# EAGLE design click sensor hub without IC 2019 (EAGLE 9.2.0)

## Sheet 1 of 2
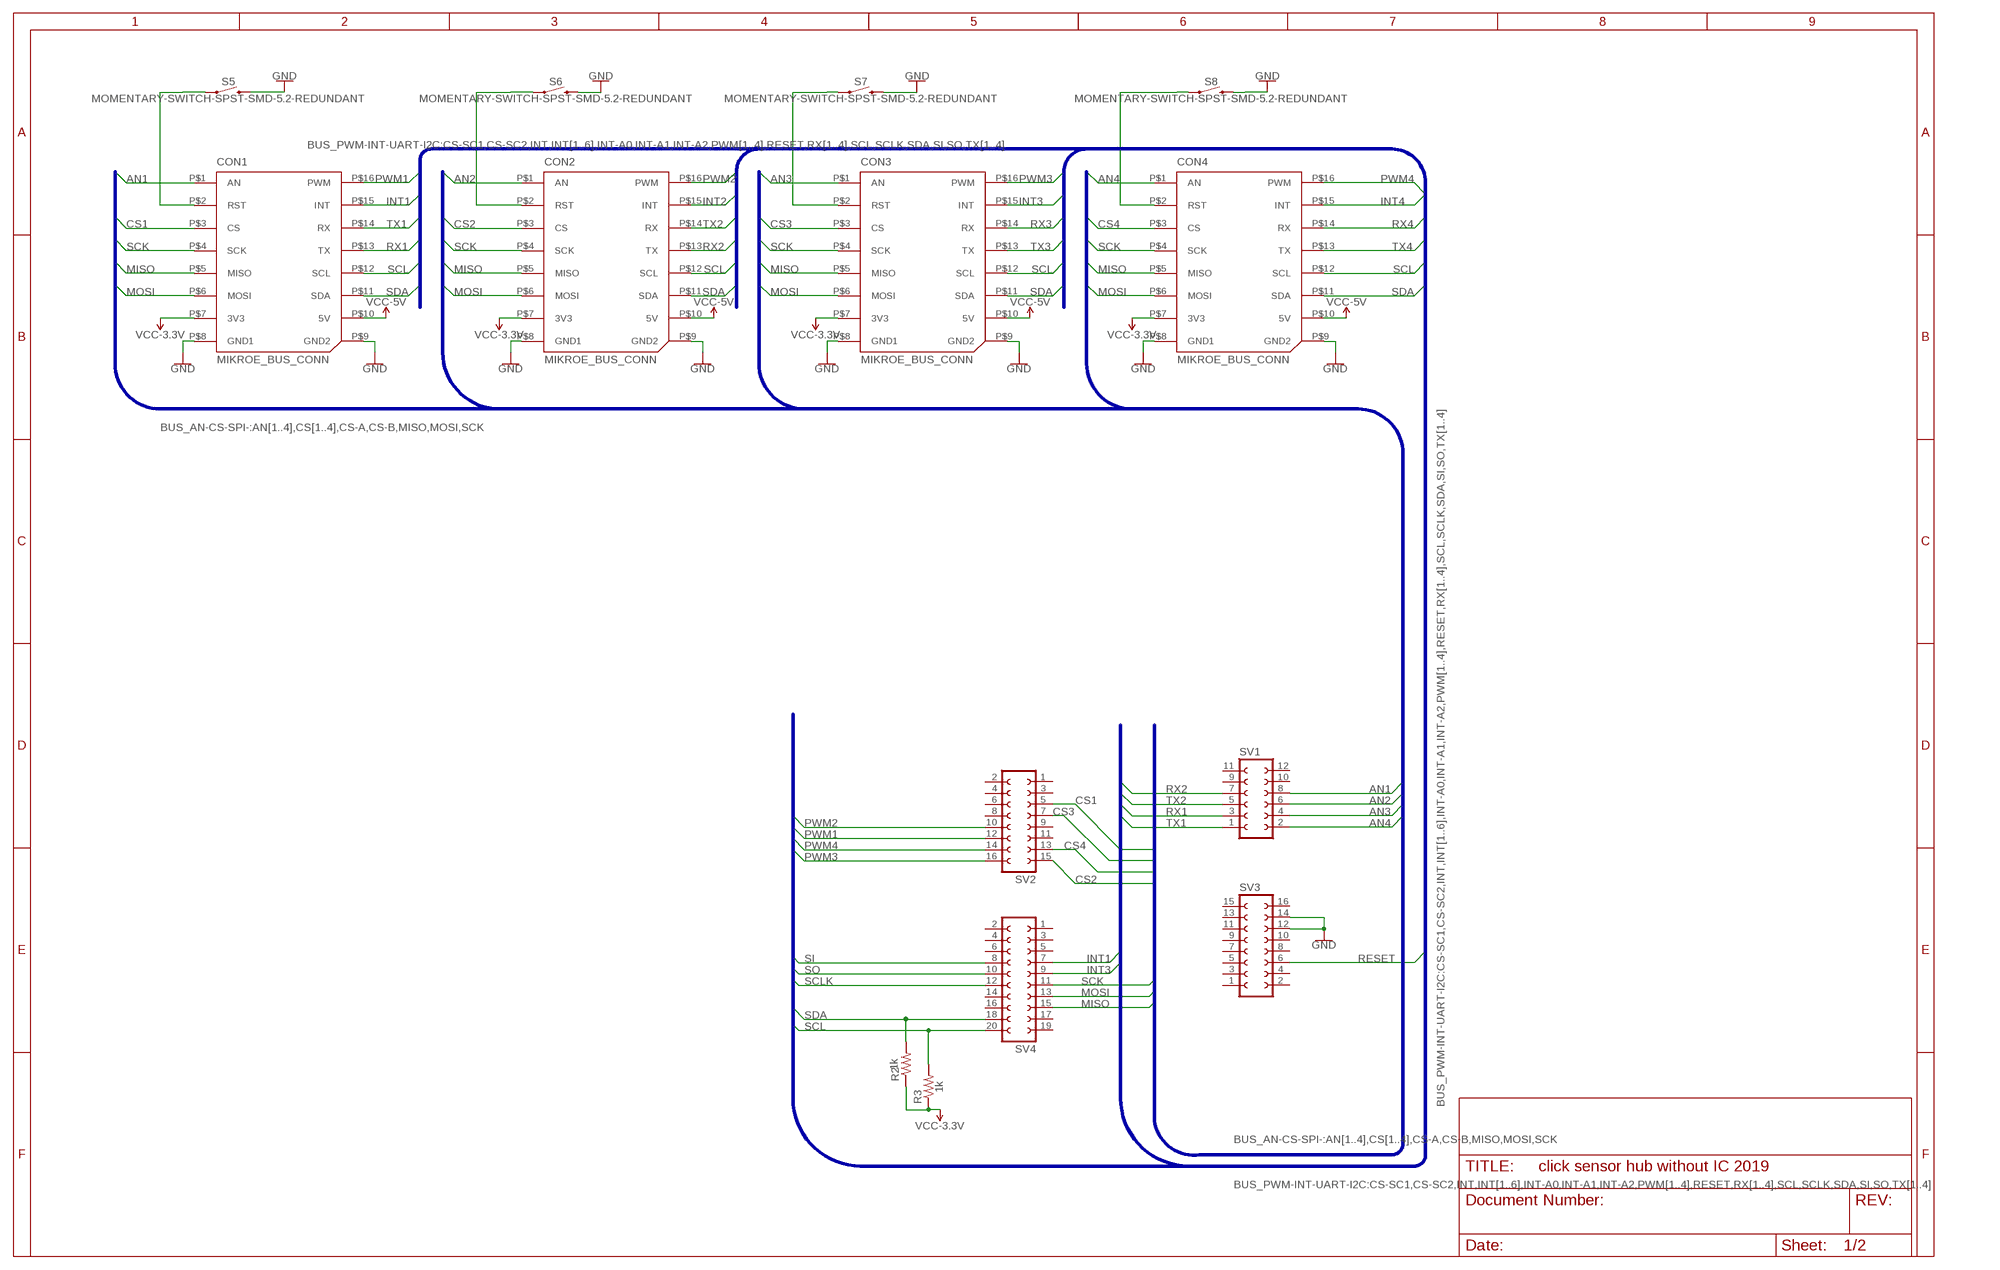
[diagram p0: schematic, sheet 1]

### Parts
CON1  MIKROE_BUS_CONN  [MIKROBUS_HOST_CONN]
CON2  MIKROE_BUS_CONN  [MIKROBUS_HOST_CONN]
CON3  MIKROE_BUS_CONN  [MIKROBUS_HOST_CONN]
CON4  MIKROE_BUS_CONN  [MIKROBUS_HOST_CONN]
R2  1k  R-US_R0805  [R0805]
R3  1k  R-US_R0805  [R0805]
S5  MOMENTARY-SWITCH-SPST-SMD-5.2-REDUNDANT  [TACTILE_SWITCH_SMD_5.2MM]
S6  MOMENTARY-SWITCH-SPST-SMD-5.2-REDUNDANT  [TACTILE_SWITCH_SMD_5.2MM]
S7  MOMENTARY-SWITCH-SPST-SMD-5.2-REDUNDANT  [TACTILE_SWITCH_SMD_5.2MM]
S8  MOMENTARY-SWITCH-SPST-SMD-5.2-REDUNDANT  [TACTILE_SWITCH_SMD_5.2MM]
SV1  FE06-2  [FE06-2]
SV2  FE08-2  [FE08-2]
SV3  FE08-2  [FE08-2]
SV4  FE10-2  [FE10-2]

### Nets
3.3V: CON1.P$7(3V3) CON2.P$7(3V3) CON3.P$7(3V3) CON4.P$7(3V3) ; supply symbol labelled VCC-3.3V ; also sheet 2
5V: CON1.P$10(5V) CON2.P$10(5V) CON3.P$10(5V) CON4.P$10(5V) ; supply symbol labelled VCC-5V ; also sheet 2
AN1: CON1.P$1(AN) SV1.8
AN2: CON2.P$1(AN) SV1.6
AN3: CON3.P$1(AN) SV1.4
AN4: CON4.P$1(AN) SV1.2
CS1: CON1.P$3(CS) SV2.5
CS2: CON2.P$3(CS) SV2.15
CS3: CON3.P$3(CS) SV2.7
CS4: CON4.P$3(CS) SV2.13
GND: CON1.P$8(GND1) CON1.P$9(GND2) CON2.P$8(GND1) CON2.P$9(GND2) CON3.P$8(GND1) CON3.P$9(GND2) CON4.P$8(GND1) CON4.P$9(GND2) S5.3 S5.4 S6.3 S6.4 S7.3 S7.4 S8.3 S8.4 SV3.12 SV3.14 ; also sheet 2
INT1: CON1.P$15(INT) SV4.7
INT2: CON2.P$15(INT)
INT3: CON3.P$15(INT) SV4.9
INT4: CON4.P$15(INT)
MISO: CON1.P$5(MISO) CON2.P$5(MISO) CON3.P$5(MISO) CON4.P$5(MISO) SV4.15
MOSI: CON1.P$6(MOSI) CON2.P$6(MOSI) CON3.P$6(MOSI) CON4.P$6(MOSI) SV4.13
N$11: CON4.P$2(RST) S8.1 S8.2
N$15: CON1.P$2(RST) S5.1 S5.2
N$16: CON2.P$2(RST) S6.1 S6.2
N$18: CON3.P$2(RST) S7.1 S7.2
PWM1: CON1.P$16(PWM) SV2.12
PWM2: CON2.P$16(PWM) SV2.10
PWM3: CON3.P$16(PWM) SV2.16
PWM4: CON4.P$16(PWM) SV2.14
RESET: SV3.6
RX1: CON1.P$13(TX) SV1.3
RX2: CON2.P$13(TX) SV1.7
RX3: CON3.P$14(RX)
RX4: CON4.P$14(RX)
SCK: CON1.P$4(SCK) CON2.P$4(SCK) CON3.P$4(SCK) CON4.P$4(SCK) SV4.11
SCL: CON1.P$12(SCL) CON2.P$12(SCL) CON3.P$12(SCL) CON4.P$12(SCL) R3.2 SV4.20
SCLK: SV4.12
SDA: CON1.P$11(SDA) CON2.P$11(SDA) CON3.P$11(SDA) CON4.P$11(SDA) R2.2 SV4.18
SI: SV4.8
SO: SV4.10
TX1: CON1.P$14(RX) SV1.1
TX2: CON2.P$14(RX) SV1.5
TX3: CON3.P$13(TX)
TX4: CON4.P$13(TX)
VDD: R2.1 R3.1 ; supply symbol labelled VCC-3.3V
Unconnected: SV1.9 SV1.10 SV1.11 SV1.12 SV2.1 SV2.2 SV2.3 SV2.4 SV2.6 SV2.8 SV2.9 SV2.11 SV3.1 SV3.2 SV3.3 SV3.4 SV3.5 SV3.7 SV3.8 SV3.9 SV3.10 SV3.11 SV3.13 SV3.15 SV3.16 SV4.1 SV4.2 SV4.3 SV4.4 SV4.5 SV4.6 SV4.14 SV4.16 SV4.17 SV4.19

### Buses
BUS_PWM-INT-UART-I2C:CS-SC1,CS-SC2,INT,INT[1..6],INT-A0,INT-A1,INT-A2,PWM[1..4],RESET,RX[1..4],SCL,SCLK,SDA,SI,SO,TX[1..4]
BUS_AN-CS-SPI-:AN[1..4],CS[1..4],CS-A,CS-B,MISO,MOSI,SCK

## Sheet 2 of 2
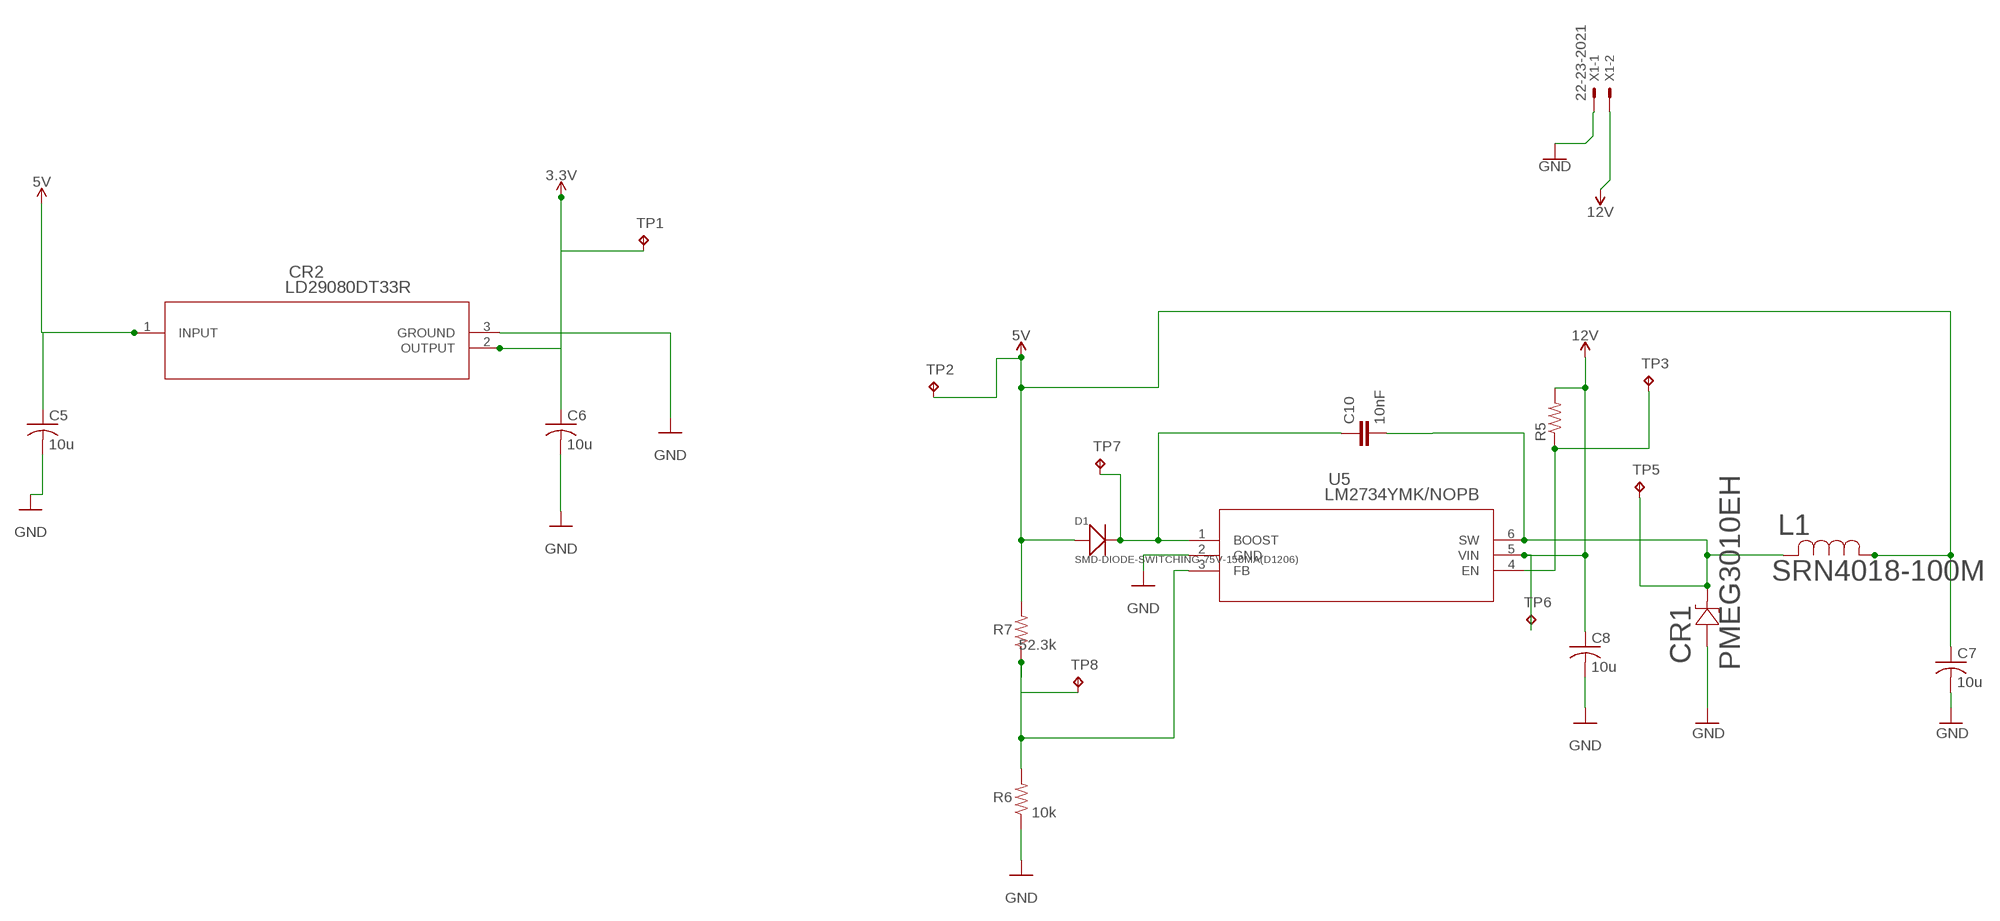
[diagram p1: schematic, sheet 2]

### Parts
C5  10u  C-USC0603K  [C0603K]
C6  10u  C-USC0603K  [C0603K]
C7  10u  C-USC0603K  [C0603K]
C8  10u  C-USC0603K  [C0603K]
C10  10nF  10NF-0603-50V-10%  [0603]
CR1  PMEG3010EH  [SOD123F]
CR2  LD29080DT33R  [DPAK]
D1  SMD-DIODE-SWITCHING-75V-150MA(D1206)  [LED-1206]
L1  SRN4018-100M  [IND_BOURNS_SRN4018]
R5  R-US_R0603  [R0603]
R6  10k  R-US_R0603  [R0603]
R7  52.3k  R-US_R0603  [R0603]
TP1  TPTP20SQ  [TP20SQ]
TP2  TPTP20SQ  [TP20SQ]
TP3  TPTP14SQ  [TP14SQ]
TP5  TPTP07SQ  [TP07SQ]
TP6  TPTP15SQ  [TP15SQ]
TP7  TPTP08SQ  [TP08SQ]
TP8  TPTP09SQ  [TP09SQ]
U5  LM2734YMK/NOPB  [MK06A]
X1  22-23-2021  [22-23-2021]

### Nets
3.3V: C6.1 CR2.2(OUTPUT) TP1.TP ; also sheet 1
5V: C5.1 C7.1 CR2.1(INPUT) D1.+ L1.1 R7.2 TP2.TP ; also sheet 1
12V: C8.1 R5.2 TP6.TP U5.5(VIN) X1.2
GND: C5.2 C6.2 C7.2 C8.2 CR1.2 CR2.3(GROUND) R6.1 U5.2(GND) X1.1 ; also sheet 1
N$1: R5.1 TP3.TP U5.4(EN)
N$3: C10.1 D1.- TP7.TP U5.1(BOOST)
N$4: R6.2 R7.1 TP8.TP U5.3(FB)
N$14: C10.2 CR1.1 L1.2 TP5.TP U5.6(SW)

## Library data of the parts
C5-C8 = rcl:C-US: CAPACITOR, American symbol; SPICEPREFIX: C
C10 = SparkFun-Capacitors:10NF: 0.01uF/10nF/10,000pF ceramic capacitors A capacitor is a passive two-terminal electrical component used to store electrical energy temporarily in an electric field. CAP-09321; PROD_ID: CAP-00867
CON1-CON4 = mikrobus_lib:MIKROE_BUS_CONN
CR1 = PMEG3010ER:PMEG3010EH: Schottky Diodes & Rectifiers; MANUFACTURER_PART_NUMBER: PMEG3010EH; VENDOR: Nexperia
CR2 = LD2908 DC to DC :LD29080DT33R; MANUFACTURER_PART_NUMBER: LD29080DT33R; VENDOR: STMicroelectronics
D1 = SMD-DIODE-SWITCHING-75V-150MA_D1206_:SMD-DIODE-SWITCHING-75V-150MA(D1206): 304040005; AVAILABILITY: Unavailable; DESCRIPTION: Diode Small Signal Switching 100V 0.15A 2-Pin Case 1206; MF: Bourns; MP: CD1206-S01575; PACKAGE: 1206 Bourns; PRICE: None
L1 = inductors DC DC:SRN4018-100M; MANUFACTURER_PART_NUMBER: SRN4018100M; VENDOR: Bourns Electronics
R2 R3 = adafruit:R-US_: RESISTOR, American symbol
R5-R7 = rcl:R-US_: RESISTOR, American symbol; SPICEPREFIX: R
S5-S8 = SparkFun-Switches:MOMENTARY-SWITCH-SPST: Momentary Switch (Pushbutton) - SPST Normally-open (NO) SPST momentary switches (buttons, pushbuttons). Variants PTH-12MM - 12mm square, through-hole Momentary Pushbutton Switch - 12mm Square <https://www.sparkfun.com/products/9190> (COM-09190) PTH-6.0MM, PTH-6.0MM-KIT - 6.0mm square, through-hole Mini Pushbutton Switch <https://www.sparkfun.com/products/97> (COM-00097) KIT package intended for soldering kit's - only one side of pads' copper is exposed. PTH-RIGHT-ANGLE-KIT - Right-angle, through-hole Right Angle Tactile Button <https://www.sparkfun.com/products/10791> - Used on SparkFun BigTime Watch Kit <https://www.sparkfun.com/products/11734> SMD-12MM - 12mm square, surface-mount Tactile Button - SMD (12mm) <https://www.sparkfun.com/products/12993> (COM-12993) Used on SparkFun PicoBoard <https://www.sparkfun.com/products/11888> SMD-4.5MM - 4.5mm Square Trackball Switch Used on SparkFun Blackberry Trackballer Breakout <https://www.sparkfun.com/products/13169> SMD-4.6MMX2.8MM - 4.60mm x 2.80mm, surface mount Used on SparkFun SAMD21 Mini Breakout <https://www.sparkfun.com/products/13664> SMD-5.2MM, SMD-5.2-REDUNDANT - 5.2mm square, surface-mount Mini Pushbutton Switch - SMD <https://www.sparkfun.com/products/8720> (COM-08720) Used on Arduino Pro Mini <https://www.sparkfun.com/products/11114> REDUNDANT package connects both switch circuits together SMD-6.0X3.5MM - 6.0 x 3.5mm, surface mount Momentary Reset Switch SMD <https://www.sparkfun.com/products/8229> (COM-08229) SMD-6.2MM-TALL - 6.2mm square, surface mount Tactile Button - SMD (6mm) <https://www.sparkfun.com/products/12992> Used on SparkFun Digital Sandbox <https://www.sparkfun.com/products/12651> SMD-RIGHT-ANGLE - Right-angle, surface mount Used on SparkFun Block for Intel® Edison - Arduino <https://www.sparkfun.com/products/13036>; PROD_ID: SWCH-08247; SF_SKU: COM-08720
SV1 = con-lsta:FE06-2: FEMALE HEADER; OC_FARNELL: unknown; OC_NEWARK: unknown
SV2 SV3 = con-lsta:FE08-2: FEMALE HEADER; OC_FARNELL: unknown; OC_NEWARK: unknown
SV4 = con-lsta:FE10-2: FEMALE HEADER; OC_FARNELL: unknown; OC_NEWARK: unknown
TP1-TP3 TP5-TP8 = testpad:TP: Test pad
U5 = LM2744:LM2734YMK/NOPB: Voltage regulator 5v; MANUFACTURER_PART_NUMBER: LM2734YMKNOPB; VENDOR: Texas Instruments
X1 = con-molex:22-23-2021: .100" (2.54mm) Center Header - 2 Pin; MF: MOLEX; MPN: 22-23-2021; OC_FARNELL: 1462926; OC_NEWARK: 25C3832

## Net classes
0 default: width 0.305 mm, drill 0.508 mm, clearance 0.254 mm

## Board
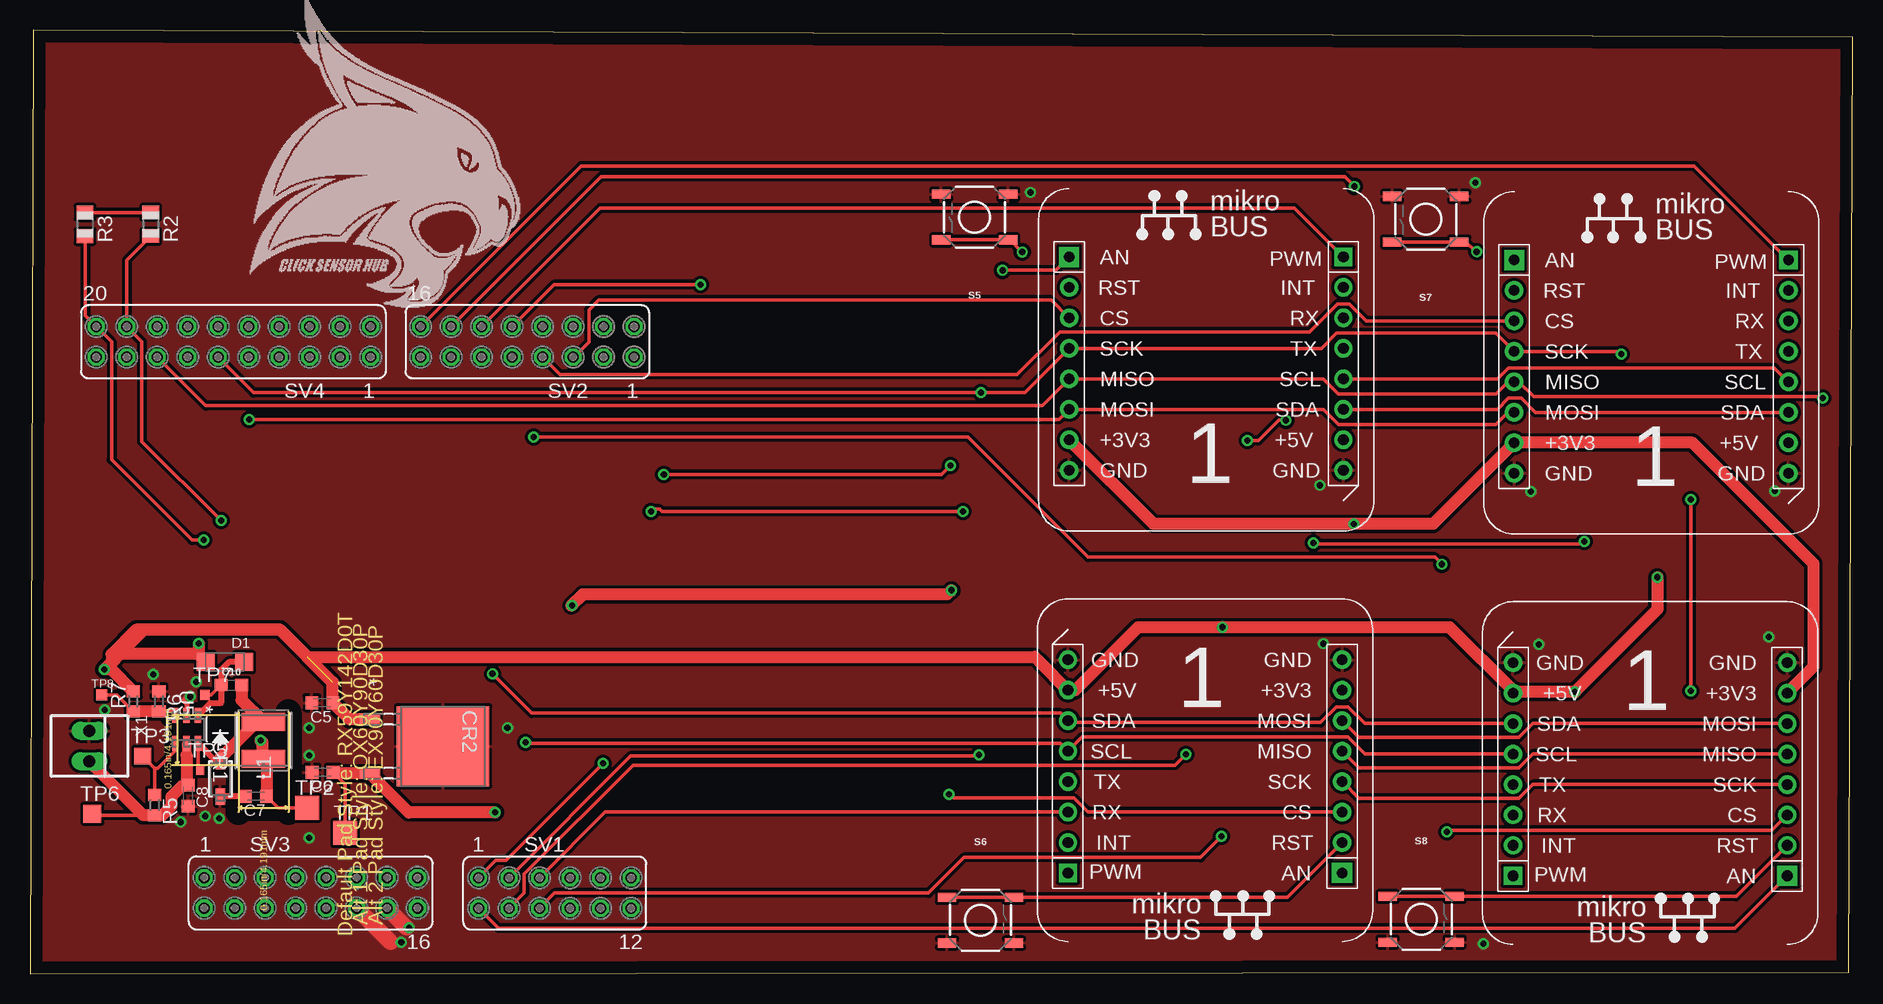
[diagram p2: board, top side]
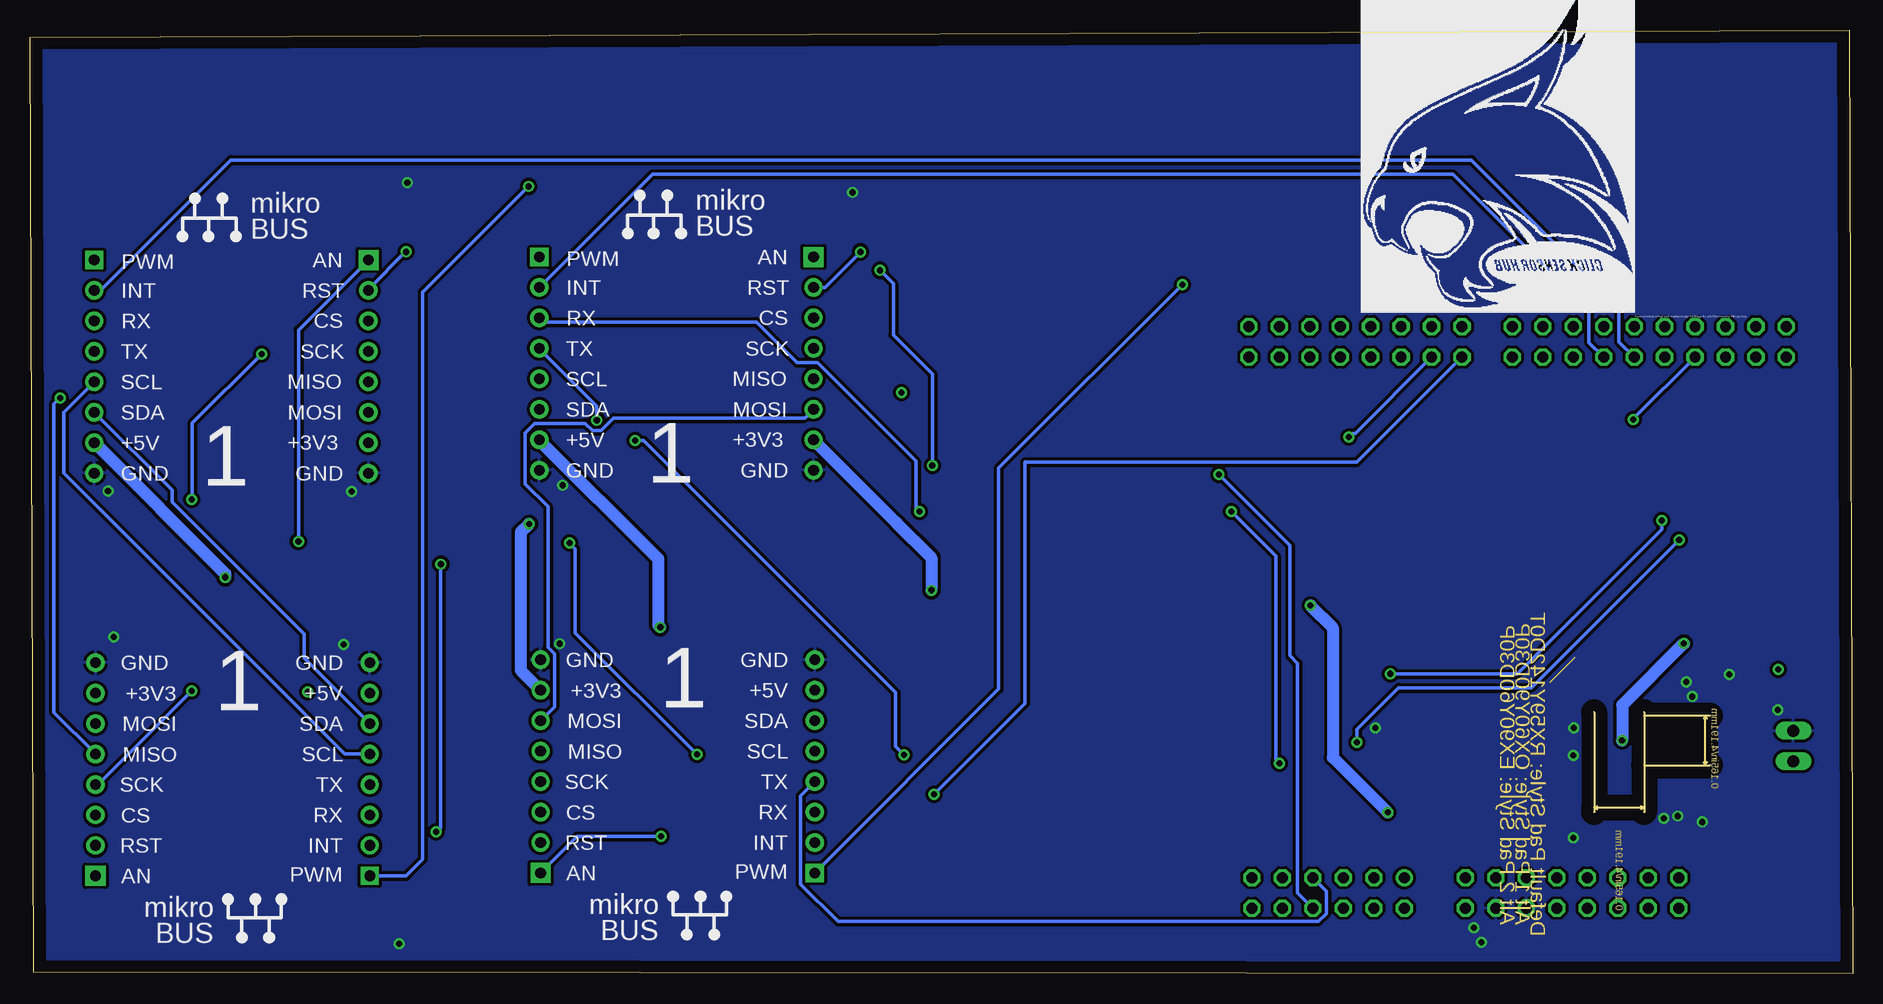
[diagram p3: board, bottom side, seen from below]

Size 151.94 x 78.68 mm. Coordinates in mm from the lower left corner, seen from the top.
Outline: 0,0 151.62,0.13 151.94,78.09 0.28,78.68 0,0
Copper layers (1*16): Top 0.035mm / dielectric 1.5mm / Bottom 0.035mm
Design rules "default": minimum track width 6mil, minimum drill 0.35mm, track to track 6mil, track to pad 6mil, pad to pad 6mil, via to via 6mil, smd to smd 6mil, copper to edge 40mil, drill to drill 6mil, minimum pad ring 10mil, minimum via ring 8mil, stop-mask expansion 4mil, vias tented up to drill 0mil, thermal gap 10mil

### Footprints (pad centres in the part's own frame; a part is rotated, then mirrored left to right if it is on the bottom)
C0603K = smd 1.05 x 1.08: 1 -0.875,0; 2 0.875,0
0603 = smd 1.1 x 1: 1 -0.85,0; 2 0.85,0
MIKROBUS_HOST_CONN = drill 0.889 pad 1.676 square: P$1 0,0 | drill 0.889 pad 1.524: P$2 0,-2.54; P$3 0,-5.08; P$4 0,-7.62; P$5 0,-10.16; P$6 0,-12.7; P$7 0,-15.24; P$8 0,-17.78; P$9 22.86,-17.78; P$10 22.86,-15.24; P$11 22.86,-12.7; P$12 22.86,-10.16; P$13 22.86,-7.62; P$14 22.86,-5.08; P$15 22.86,-2.54 | drill 0.889 pad 1.524 square: P$16 22.86,0
SOD123F = smd 1.372 x 0.762: 1 -1.473,0; 2 1.473,0
DPAK = smd 0.94 x 1.702: 1 -2.25,-6.109; 2 2.25,-6.109 | smd 6.655 x 7.722: 3 0,0
LED-1206 = smd 1.5 x 1.5: + -1.6,0; - 1.6,0
IND_BOURNS_SRN4018 = smd 1.499 x 3.607: 1 -1.524,0; 2 1.524,0
R0805 = smd 1.1 x 1.4: 1 -1,0; 2 1,0
R0603 = smd 1 x 1.1: 1 -0.85,0; 2 0.85,0
TACTILE_SWITCH_SMD_5.2MM = smd 1.524 x 0.762: 1 -2.794,1.905; 2 2.794,1.905; 3 -2.794,-1.905; 4 2.794,-1.905
FE06-2 = drill 0.914: 1 -6.35,1.27 | drill 0.914 octagon: 2 -6.35,-1.27; 3 -3.81,1.27; 4 -3.81,-1.27; 5 -1.27,1.27; 6 -1.27,-1.27; 7 1.27,1.27; 8 1.27,-1.27; 9 3.81,1.27; 10 3.81,-1.27; 11 6.35,1.27; 12 6.35,-1.27
FE08-2 = drill 0.914 octagon: 1 -8.89,1.27; 2 -8.89,-1.27; 3 -6.35,1.27; 4 -6.35,-1.27; 5 -3.81,1.27; 6 -3.81,-1.27; 7 -1.27,1.27; 8 -1.27,-1.27; 9 1.27,1.27; 10 1.27,-1.27; 11 3.81,1.27; 12 3.81,-1.27; 13 6.35,1.27; 14 6.35,-1.27; 15 8.89,1.27; 16 8.89,-1.27
FE10-2 = drill 0.914 octagon: 1 -11.43,1.27; 2 -11.43,-1.27; 3 -8.89,1.27; 4 -8.89,-1.27; 5 -6.35,1.27; 6 -6.35,-1.27; 7 -3.81,1.27; 8 -3.81,-1.27; 9 -1.27,1.27; 10 -1.27,-1.27; 11 1.27,1.27; 12 1.27,-1.27; 13 3.81,1.27; 14 3.81,-1.27; 15 6.35,1.27; 16 6.35,-1.27; 17 8.89,1.27; 18 8.89,-1.27; 19 11.43,1.27; 20 11.43,-1.27
TP20SQ = smd 2 x 2: TP 0,0
TP14SQ = smd 1.4 x 1.4: TP 0,0
TP07SQ = smd 0.7 x 0.7: TP 0,0
TP15SQ = smd 1.5 x 1.5: TP 0,0
TP08SQ = smd 0.8 x 0.8: TP 0,0
TP09SQ = smd 0.9 x 0.9: TP 0,0
MK06A = smd 1.219 x 0.533: 1 -1.168,0.95; 2 -1.168,0; 3 -1.168,-0.95; 4 1.168,-0.95; 5 1.168,0; 6 1.168,0.95
22-23-2021 = drill 1 long: 1 -1.27,0; 2 1.27,0

### Placement (x,y rotation side)
C5  24.37,22.59 180 top
C6  24.39,16.8 180 top
C7  18.83,14.8 180 top
C8  13.17,14.84 270 top
C10  16.78,24.08 0 top
CON1  86.62,59.76 0 top
CON2  109.38,8.4 180 top
CON3  123.72,59.51 0 top
CON4  146.48,8.16 180 top
CR1  15.87,16.24 270 top
CR2  34.42,18.96 270 top
D1  16.23,25.99 0 top
L1  19.46,19.45 90 top
R2  10.06,62.49 270 top
R3  4.59,62.47 270 top
R5  10.39,14.06 270 top
R6  10.74,22.7 270 top
R7  8.61,22.7 90 top
S5  78.75,63.09 180 top
S6  79.23,4.47 0 top
S7  116.34,62.91 180 top
S8  115.96,4.54 0 top
SV1  43.74,6.74 0 top
SV2  41.45,52.68 180 top
SV3  23.4,6.74 0 top
SV4  16.95,52.68 180 top
TP1  26.29,11.74 0 top
TP2  23.09,13.84 0 top
TP3  9.39,18.14 0 top
TP5  14.19,16.94 0 top
TP6  5.19,13.34 0 top
TP7  14.59,23.24 0 top
TP8  5.99,23.24 0 top
U5  13.05,20.37 270 top
X1  4.95,18.99 270 top

### Tracks (layer width: path | path; a pad name or v marks a point on that pad's centre or on a via)
3.3V  (via drill 0.51)
  Top 0.305: TP1.TP 26.29,15.79 C6.1 25.36,16.71
  Top 1.002: 46.08,31.62 45.12,30.66 45.14,30.66 v45.19,30.71
  Top 1.016: CON1.P$7 93.64,37.5 v110.34,37.5 116.95,37.5 CON3.P$7 138.58,44.27 148.66,34.19 148.66,25.58 CON4.P$7 | 46.08,31.62 76.45,31.62 v76.8,31.97 | v38.76,13.45 31.58,13.45 CR2.2 25.36,16.71
  Bottom 1.002: CON1.P$7 79.74,37.64 | v45.19,30.71 43.34,28.86 43.34,18.03 v38.76,13.45
  Bottom 1.016: CON2.P$7 111.03,25.29 111.03,36.81 v110.34,37.5 | 79.74,37.64 76.8,34.7 v76.8,31.97
5V  (via drill 0.51)  (1 unrouted)
  Top 0.305: 23.03,26.5 23.12,26.41 | TP2.TP 20.67,13.84 C7.1
  Top 1.016: 123.71,23.49 v128.77,23.49 135.66,30.38 v135.66,33.06 | 123.71,23.49 CON4.P$10 | 123.71,23.49 118.32,28.89 v99.4,28.89 92.37,28.89 87.12,23.64 CON2.P$10 84.18,25.98 | R7.2 6.79,25.37 v6.19,25.37 9.52,28.7 20.83,28.7 | C7.1 19.71,17.69 L1.1 19.46,18.09 19.35,18.2 19.35,19.31 v19.22,19.44 | v14.06,27.53 14.06,26.56 | 14.06,26.56 13.97,26.65 7.47,26.65 6.79,25.97 6.79,26.63 8.86,28.7 19.99,28.7 20.83,28.7 | D1.+ 14.06,26.56 | 84.18,25.98 83.74,26.41 | 20.83,28.7 25.25,24.29 C5.1 26.63,21.21 CR2.1 | 83.74,26.41 84.18,25.98 | 23.12,26.41 83.74,26.41
  Bottom 1.016: CON1.P$10 99.57,34.61 99.57,29.07 v99.4,28.89 | CON3.P$10 135.66,33.35 v135.66,33.06 | v19.22,19.44 19.22,22.37 v14.06,27.53
12V
  Top 0.305: TP6.TP 5.32,13.21 R5.2
  Top 0.5: C8.1 12.9,15.72 | 13.05,15.87 12.9,15.72 | 12.9,15.72 12.84,15.66
  Top 0.8: U5.5 13.05,18.23
  Top 1: 13.05,18.23 13.05,15.87
  Top 1.016: X1.2 9.45,13.21 R5.2 11.02,13.21 11.77,13.96 11.77,14.76 12.67,15.66 12.84,15.66
AN1  (via drill 0.51)
  Top 0.305: v52.83,41.61 75.97,41.61 v76.72,42.36 | v81.08,58.64 85.51,58.64 CON1.P$1
  Bottom 0.305: v52.83,41.61 46.91,35.69 46.91,26.52 46.28,25.89 46.28,6.74 SV1.8 | v76.72,42.36 76.72,50.01 79.96,53.25 79.96,57.53 v81.08,58.64
AN2  (via drill 0.51)
  Top 0.305: SV1.6 43.74,6.74 74.9,6.74 77.86,9.7 97.58,9.7 v99.32,11.44
  Bottom 0.305: v99.32,11.44 106.34,11.44 CON2.P$1
AN3  (via drill 0.51)
  Top 0.305: v129.56,36.04 129.33,35.81 107.05,35.81 v106.96,35.9 | SV1.4 41.2,6.74 41.2,8.32 50.27,17.39 95.44,17.39 v96.35,18.3
  Bottom 0.305: v129.56,36.04 129.56,53.67 CON3.P$1 | v96.35,18.3 106.48,28.43 106.48,35.42 v106.96,35.9
AN4
  Top 0.305: SV1.2 39.06,3.8 142.11,3.8 CON4.P$1
CS1
  Top 0.305: CON1.P$3 85.15,56.14 47.39,56.14 46.59,55.34 46.59,52.64 45.36,51.41 SV2.5
CS2  (via drill 0.51)
  Top 0.305: CON2.P$3 88.17,13.48 87,14.65 76.98,14.65 76.79,14.84 76.69,14.84 v76.59,14.94
  Bottom 0.305: v76.59,14.94 68.99,22.54 68.99,42.64 41.33,42.64 SV2.15
CS3
  Top 0.305: SV2.7 44.19,49.94 82.29,49.94 85.85,53.51 106.66,53.51 108.99,55.84 109.96,55.84 111.38,54.43 CON3.P$3
CS4  (via drill 0.51)
  Top 0.305: v41.99,44.74 78.19,44.74 88.19,34.74 117.09,34.74 v117.69,34.14 | v118.09,11.84 118.19,11.94 145.18,11.94 CON4.P$3
  Bottom 0.305: SV2.13 41.47,45.04 41.69,45.04 v41.99,44.74 | v117.69,34.14 117.69,12.14 117.99,11.84 v118.09,11.84
GND  (via drill 0.51)
  Top 0.305: 23.52,17.05 C6.2
  Top 0.4: 13.05,22.79 U5.2
  Top 0.5: C7.2 15.91,14.8 CR1.2 | v31.59,3.84 31.38,3.84
  Top 0.8: v30.95,2.62 30.06,2.62 | v13.36,23.1 13.05,22.79
  Top 1.3: 30.06,2.62 SV3.12 | 31.38,3.84 SV3.14
  other vias: 125.77,27.46 125.11,40.21 145.43,40.23 107.52,40.73 107.8,27.52 144.95,28.07 120.48,65.96 121.15,2.49 12.55,12.64 10.28,24.95 13.86,24.32 6.24,21.98 15.75,12.96 39.79,20.5 23.25,20.5 23.27,18.19 14.59,13.14 23.29,11.34 83.39,65.14
  pour Top: -0.69,79.38 -0.69,-0.28 151.79,-0.28 151.79,79.38
  pour Bottom: -0.73,78.62 -0.73,-0.16 151.7,-0.16 151.7,78.62
INT1
  Bottom 0.305: SV4.7 21.99,52.64 21.99,55.32 33.31,66.64 100.05,66.64 CON1.P$15
INT3
  Bottom 0.305: SV4.9 19.49,52.68 19.49,55.54 31.79,67.84 135.19,67.84 146.06,56.97 CON3.P$15
MISO  (via drill 0.51)
  Top 0.305: CON2.P$5 110.78,17.15 124.1,17.15 125.27,18.32 CON4.P$5 | SV4.15 14.65,47.37 84.39,47.37 CON1.P$5 107.83,49.6 109.08,48.34 122.17,48.34 123.18,49.35 CON3.P$5 124.12,49.35 125.35,48.11 149.32,48.11 v149.42,48.01
  Bottom 0.305: CON4.P$5 149.95,21.8 149.95,47.48 v149.42,48.01
MOSI  (via drill 0.51)
  Top 0.305: CON4.P$6 125.27,20.86 124.1,19.69 110.78,19.69 CON2.P$6 | CON3.P$6 123.18,46.81 122.17,45.8 109.08,45.8 107.83,47.06 CON1.P$6 85.77,46.21 v18.29,46.21
  Bottom 0.305: v18.29,46.21 18.29,46.27 SV4.13 | CON2.P$6 108.21,22.27 108.21,26.66 108.75,27.21 108.75,38.93 110.65,40.83 110.65,45.1 109.86,45.88 105.65,45.88 105.05,45.28 104.33,45.28 103.82,45.79 103.82,45.81 103.29,46.34 87.33,46.34 CON1.P$6
N$1
  Top 0.305: U5.4 12.1,18.58 10.66,17.14 10.39,17.14 | 10.39,17.14 R5.1 | 10.39,17.14 TP3.TP
N$3
  Top 0.305: TP7.TP 15.09,23.24 C10.1
  Top 0.5: D1.- 16.58,25.99 15.93,25.34 C10.1 15.93,22.59 15.89,22.54 15.01,22.54 U5.1
N$4
  Top 0.305: U5.3 11.79,21.85 R6.2 | TP8.TP 7.23,23.24 R7.1
  Top 1.016: R6.2 R7.1
N$11
  Top 0.305: S8.1 S8.2 142.22,6.44 CON4.P$2
N$14
  Top 0.305: TP5.TP 14,17.13 U5.6
  Top 0.5: CR1.1 15.49,17.72 U5.6
  Top 1.016: C10.2 17.63,22.81 L1.2 18.88,20.98 15.87,17.97 CR1.1
N$15  (via drill 0.51)
  Top 0.305: S5.2 S5.1 81.7,61.19 v82.71,60.18
  Bottom 0.305: v82.71,60.18 85.67,57.22 CON1.P$2
N$16
  Top 0.305: CON2.P$2 104.81,6.37 S6.1 S6.2
N$18  (via drill 0.51)
  Top 0.305: S7.2 S7.1 119.2,61.07 119.62,61.07 120.5,60.19 v120.59,60.19
  Bottom 0.305: v120.59,60.19 120.61,60.21 123.72,57.1 CON3.P$2
PWM1
  Top 0.305: SV2.12 47.53,63.84 105.39,63.84 CON1.P$16
PWM2  (via drill 0.51)
  Top 0.305: SV2.10 43.67,57.44 v55.89,57.44
  Bottom 0.305: CON2.P$16 71.19,23.73 71.19,42.14 v55.89,57.44
PWM3
  Top 0.305: SV2.16 45.95,67.34 138.74,67.34 CON3.P$16
PWM4  (via drill 0.51)
  Top 0.305: SV2.14 47.59,66.44 109.59,66.44 v110.39,65.64
  Bottom 0.305: v110.39,65.64 119.19,56.84 119.19,9.54 120.57,8.16 CON4.P$16
RX1  (via drill 0.51)
  Top 0.305: SV1.3 50.07,18.14 78.99,18.14 v79.09,18.24 | v101.49,44.44 102.39,44.44 104.09,46.14 v104.69,46.14
  Bottom 0.305: v79.09,18.24 79.79,18.94 79.79,23.44 100.79,44.44 v101.49,44.44 | v104.69,46.14 104.69,47.35 CON1.P$13
RX2
  Bottom 0.305: SV1.7 43.89,6.89 43.89,5.01 44.55,4.35 84.57,4.35 87.69,7.47 87.69,14.85 CON2.P$13
SCK  (via drill 0.51)
  Top 0.305: CON4.P$4 125.27,15.78 124.1,14.61 110.78,14.61 CON2.P$4 | v132.63,51.66 132.4,51.89 131.44,51.89 CON3.P$4 122.21,53.4 108.91,53.4 107.65,52.14 CON1.P$4 82.94,48.45 v79.27,48.45 18.64,48.45 SV4.11 | v138.45,39.52 v138.45,23.6
  Bottom 0.305: v132.63,51.66 138.4,45.9 138.4,39.57 v138.45,39.52 | v138.45,23.6 146.27,15.78 CON4.P$4
SCL  (via drill 0.51)
  Top 0.305: R3.2 4.59,54.89 SV4.20 6.79,52.68 6.79,42.87 13.51,36.15 v14.47,36.15 | CON3.P$12 145.41,50.52 123.23,50.52 122.31,49.6 CON1.P$12 | CON4.P$12 111.27,18.32 109.86,19.73 87.69,19.73 CON2.P$12 85.89,19.19 41.4,19.19 v41.31,19.27
  Bottom 0.305: CON3.P$12 149.14,46.78 149.14,41.76 125.7,18.32 CON4.P$12 | v41.31,19.27 41.31,20.37 37.85,23.83 26.79,23.83 v14.47,36.15
SDA  (via drill 0.51)
  Top 0.305: CON4.P$11 111.27,20.86 109.86,22.27 108.89,22.27 107.57,20.95 86.67,20.95 CON2.P$11 85.89,21.73 41.83,21.73 v38.54,25.01 | v15.92,37.77 9.33,44.37 9.33,52.68 SV4.18 8.06,59.49 R2.2 | CON1.P$11 122.31,47.06 123.23,47.98 124.3,47.98 125.47,46.81 CON3.P$11
  Bottom 0.305: CON4.P$11 129.08,26.32 129.08,28.32 140.09,39.33 140.09,40.32 CON3.P$11 | v15.92,37.77 15.92,37.05 27.96,25.01 v38.54,25.01
TX1  (via drill 0.51)
  Top 0.305: v77.79,38.54 52.69,38.54 52.49,38.74 51.99,38.74 v51.79,38.54 | v47.79,17.54 39.69,9.44 38.83,9.44 SV1.1
  Bottom 0.305: v77.79,38.54 78.09,38.84 78.09,42.74 86.29,50.94 87.99,50.94 91.39,54.34 109.15,54.34 CON1.P$14 | v51.79,38.54 48.09,34.84 48.09,17.84 v47.79,17.54
TX2
  Top 0.305: CON2.P$14 47.94,13.48 SV1.5
VDD
  Top 0.305: R2.1 R3.1

### Text on the board
bPlace: /Users/mohamedsghari/Desktop/design PCB/logo for pcb/Monochrome Bitmap.bmp